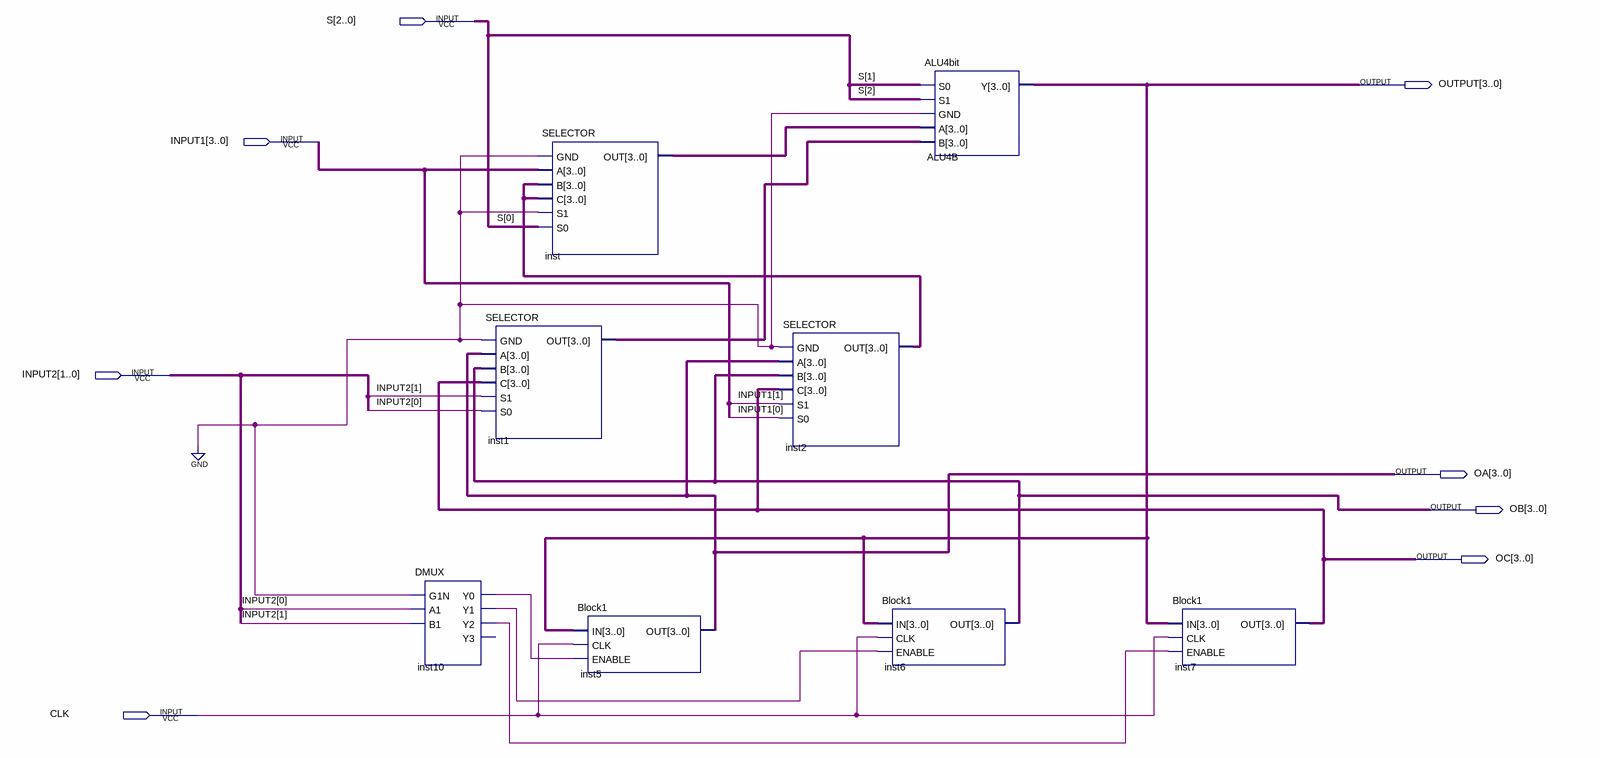
[diagram p0: schematic sheet]
// Quartus schematic ASSIGNMENT.bdf as structural Verilog: 8 symbols, 8 pins
module ASSIGNMENT (
  input  [2:0] S,
  input  [3:0] INPUT1,
  input  [1:0] INPUT2,
  input  CLK,
  output [3:0] OUTPUT,
  output [3:0] OA,
  output [3:0] OB,
  output [3:0] OC
);

  wire inst10_y0, inst10_y1, inst10_y2;
  wire [3:0] inst1_out, inst2_out, inst_out;

  DMUX inst10 (.G1N(1'b0), .A1(INPUT2[0]), .B1(INPUT2[1]), .Y0(inst10_y0), .Y1(inst10_y1), .Y2(inst10_y2));  // open: Y3
  SELECTOR inst1 (.GND(1'b0), .A(OA), .B(OB), .C(OC), .S1(INPUT2[1]), .S0(INPUT2[0]), .OUT(inst1_out));
  SELECTOR inst (.GND(1'b0), .A(INPUT1), .B(inst2_out), .C(inst2_out), .S1(1'b0), .S0(S[0]), .OUT(inst_out));
  Block1 inst5 (.IN(OUTPUT), .CLK(CLK), .ENABLE(inst10_y0), .OUT(OA));
  SELECTOR inst2 (.GND(1'b0), .A(OA), .B(OB), .C(OC), .S1(INPUT1[1]), .S0(INPUT1[0]), .OUT(inst2_out));
  Block1 inst6 (.IN(OUTPUT), .CLK(CLK), .ENABLE(inst10_y1), .OUT(OB));
  ALU4bit ALU4B (.S0(S[1]), .S1(S[2]), .GND(1'b0), .A(inst_out), .B(inst1_out), .Y(OUTPUT));
  Block1 inst7 (.IN(OUTPUT), .CLK(CLK), .ENABLE(inst10_y2), .OUT(OC));
endmodule
